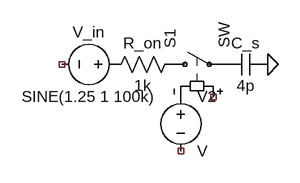
[diagram p0: schematic Draft2.asc]
Draft2.asc, the LTspice schematic file:
Version 4
SHEET 1 880 680
FLAG 624 288 0
SYMBOL voltage 416 288 R90
WINDOW 0 -32 56 VBottom 2
WINDOW 3 32 56 VTop 2
SYMATTR InstName V_in
SYMATTR Value SINE(1.25 1 100k)
SYMBOL res 384 304 R270
WINDOW 0 32 56 VTop 2
WINDOW 3 0 56 VBottom 2
SYMATTR InstName R_on
SYMATTR Value 1k
SYMBOL cap 624 272 R90
WINDOW 0 0 32 VBottom 2
WINDOW 3 32 32 VTop 2
SYMATTR InstName C_s
SYMATTR Value 4p
SYMBOL sw 464 288 R270
WINDOW 0 38 16 Center 2
SYMATTR InstName S1
SYMBOL voltage 496 320 R0
SYMATTR InstName V2

The netlist it stands for:
* Draft2.asc
V_in P001 NC_01 SINE(1.25 1 100k)
R_on P001 P002 1k
C_s 0 P003 4p
S1 P002 P003 NC_02 P004 SW
V2 P004 NC_03 V
.backanno
.end